# EAGLE design untitled (EAGLE 9.6.2)
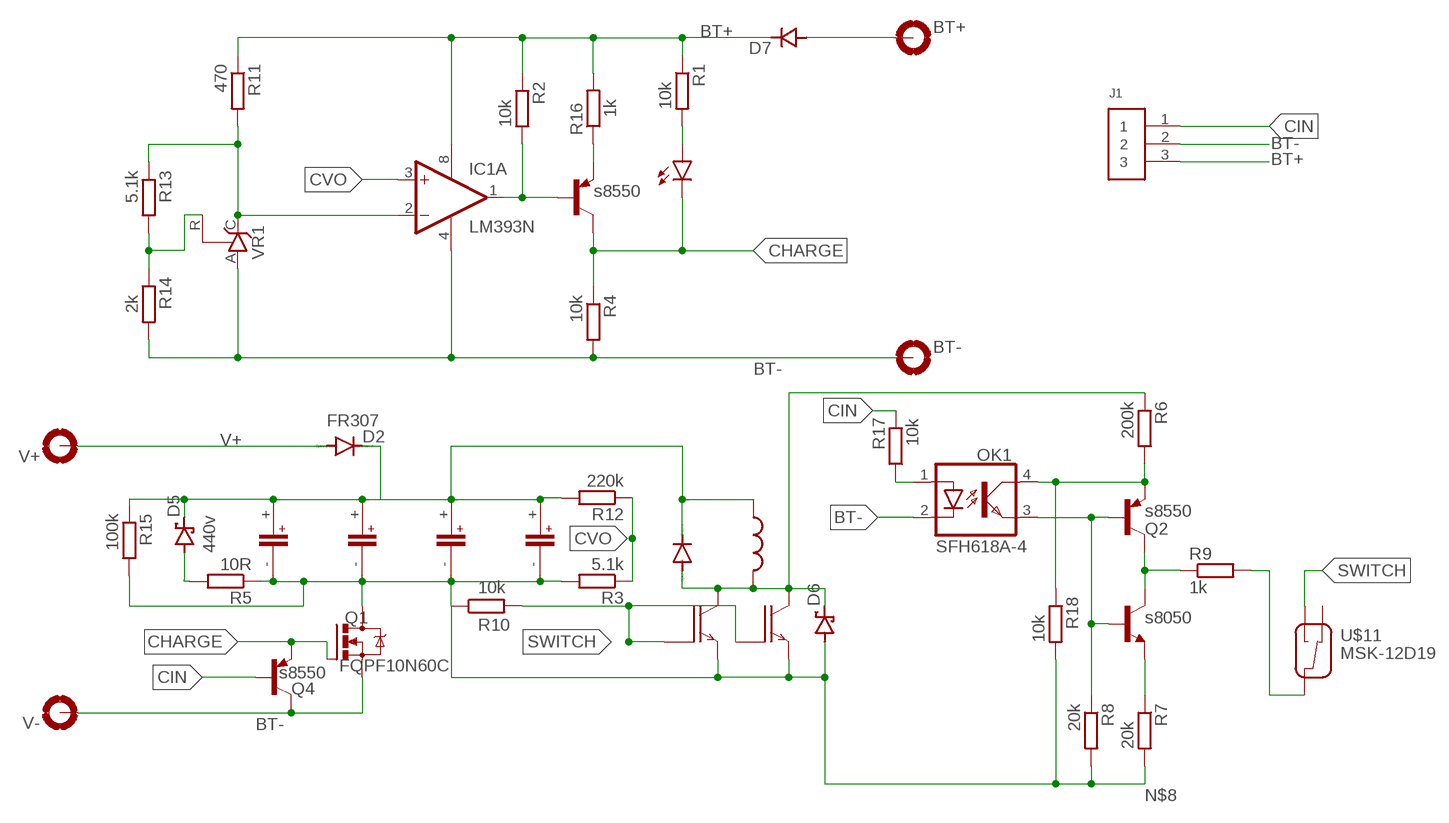
[diagram p0: schematic, sheet 1]

## Parts
BT+  MOUNT-PAD-ROUND3.0  [3,0-PAD]
BT-  MOUNT-PAD-ROUND3.0  [3,0-PAD]
D1  SB320  [DO201-15]
D2  FR307  1N5060GP  [DO15-12]
D5  440v  DS_E2L  [E2LINE]
D6  DS_E2L  [E2LINE]
D7  D_E2L  [E2LINE]
IC1  LM393N  [DIL08]
J1  61300311121  [61300311121]
LED1  TLLY4400  [LED3MM]
OK1  SFH618A-4  [DIP4]
Q1  FQPF10N60C  IRF740  [TO220BV]
Q2  s8550  2N3906  [TO92]
Q3  s8550  2N3906  [TO92]
Q4  s8550  2N3906  [TO92]
R1  10k  R-EU_0207/2V  [0207/2V]
R2  10k  R-EU_0207/2V  [0207/2V]
R3  5.1k  R-EU_0207/2V  [0207/2V]
R4  10k  R-EU_0207/2V  [0207/2V]
R5  10R  R-EU_0207/2V  [0207/2V]
R6  200k  R-EU_0207/2V  [0207/2V]
R7  20k  R-EU_0207/2V  [0207/2V]
R8  20k  R-EU_0207/2V  [0207/2V]
R9  1k  R-EU_0309/12  [0309/12]
R10  10k  R-EU_0207/2V  [0207/2V]
R11  470  R-EU_0207/2V  [0207/2V]
R12  220k  R-EU_0207/2V  [0207/2V]
R13  5.1k  R-EU_0207/2V  [0207/2V]
R14  2k  R-EU_0207/2V  [0207/2V]
R15  100k  R-EU_0207/2V  [0207/2V]
R16  1k  R-EU_0207/2V  [0207/2V]
R17  10k  R-EU_0207/2V  [0207/2V]
R18  10k  R-EU_0207/2V  [0207/2V]
T3  s8050  2N3704  [TO92]
U$1  RUBYCON_450V_270UF  [RUBYCON_22*40]
U$2  RUBYCON_450V_270UF  [RUBYCON_22*40]
U$3  RUBYCON_450V_270UF  [RUBYCON_22*40]
U$4  RUBYCON_450V_270UF  [RUBYCON_22*40]
U$6  COIL-301025  [30*10*25]
U$9  IGBT-N-TO247  [TO-247AD-V]
U$11  MSK-12D19  [12D19]
U$13  IGBT-N-TO247  [TO-247AD-V]
V+  MOUNT-PAD-ROUND3.0  [3,0-PAD]
V-  MOUNT-PAD-ROUND3.0  [3,0-PAD]
VR1  TL431CLP  [TO92-CLP]

## Nets
BT+: D7.1(C) IC1.8(P:V+) J1.3 R1.1 R2.1 R11.1 R16.2
BT-: BT-.B3,0(MOUNT) IC1.4(P:V-) J1.2 OK1.2(C) Q1.S Q4.1(C) R4.2 R14.2 V-.B3,0(MOUNT) VR1.A
CHARGE: LED1.K(C) Q1.G Q3.1(C) Q4.3(E) R4.1
CIN: J1.1 Q4.2(B) R17.2
CVO: IC1.3(A:+IN) R3.1 R12.1
N$1: IC1.1(A:OUT) Q3.2(B) R2.2
N$2: BT+.B3,0(MOUNT) D7.2(A)
N$3: D5.2(A) R5.2
N$4: D1.A D6.1(K) R6.1 U$6.P$2 U$9.C U$13.C
N$5: IC1.2(A:-IN) R11.2 R13.1 VR1.C
N$6: LED1.A R1.2
N$7: R13.2 R14.1 VR1.R
N$8: D6.2(A) Q1.D R3.2 R5.1 R7.2 R8.2 R10.1 R15.2 R18.2 U$1.- U$2.- U$3.- U$4.- U$9.E U$13.E
N$9: Q2.1(C) R9.1 T3.2(C)
N$10: Q3.3(E) R16.1
N$11: OK1.4(COL) Q2.3(E) R6.2 R18.1
N$12: OK1.1(A) R17.1
N$13: R7.1 T3.3(E)
N$14: OK1.3(EMIT) Q2.2(B) R8.1 T3.1(B)
N$15: R9.2 U$11.COM
SWITCH: R10.2 U$9.G U$11.NO U$13.G
UC: D1.C D2.C D5.1(K) R12.2 R15.1 U$1.+ U$2.+ U$3.+ U$4.+ U$6.P$1
V+: D2.A V+.B3,0(MOUNT)
Unconnected: IC1.5(B:+IN) IC1.6(B:-IN) IC1.7(B:OUT) U$11.NC

## Library data of the parts
BT+ BT- V+ V- = holes:MOUNT-PAD-ROUND: MOUNTING PAD, round
D1 = diode:SB320: DIODE barrier rectifier, 3 A (Fairchild)
D2 = diode:1N5060GP: DIODE controlled avalanche rectifier
D5 D6 = zetex:DS_E2L: SHOTTKY DIODE; OC_FARNELL: unknown; OC_NEWARK: unknown
D7 = zetex:D_E2L: DIODE; OC_FARNELL: unknown; OC_NEWARK: unknown
IC1 = linear:LM393: COMPARATOR
J1 = Headers:61300311121: CONN HEADER VERT 3POS 2.54MM Manufacturer's datasheet <https://katalog.we-online.de/em/datasheet/6130xx11121.pdf>; CREATED_BY: PCBLayout.com; DIGI_KEY_PART_NUMBER: 732-5316-ND; MANUFACTURER: Wurth Electronics Inc.; MPN: 61300311121
LED1 = led:TLLY4400: Low Current (2mA) LED 3 mm Tinted Diffused Package color YELLOW Source: Data sheet <http://www.farnell.com/datasheets/391098.pdf>; MF: VISHAY SEMICONDUCTOR; OC_FARNELL: 1612439
OK1 = optocoupler:SFH618?*: Optocoupler, Phototransistor Output, Low Input Current Source: Data sheet <http://www.vishay.com/docs/83673/sfh618.pdf>; MF: VISHAY/TELEFUNKEN; MPN: SFH618A-4; OC_FARNELL: 5805673; OC_NEWARK: 21H7746
Q1 = transistor-power:IRF740: N-CHANNEL MOS FET
Q2-Q4 = transistor-pnp:2N3906: PNP Transistor
R1-R18 = rcl:R-EU_: RESISTOR, European symbol; SPICEPREFIX: R
T3 = transistor:2N3704: NPN TRANSISTOR
U$1-U$4 = untitled:RUBYCON_450V_270UF
U$6 = untitled:COIL-30*10*25
U$9 U$13 = untitled:IGBT-N-TO247
U$11 = untitled:MSK-12D19
VR1 = v-reg:TL431CLP: VOLTAGE REGULATOR

## Board
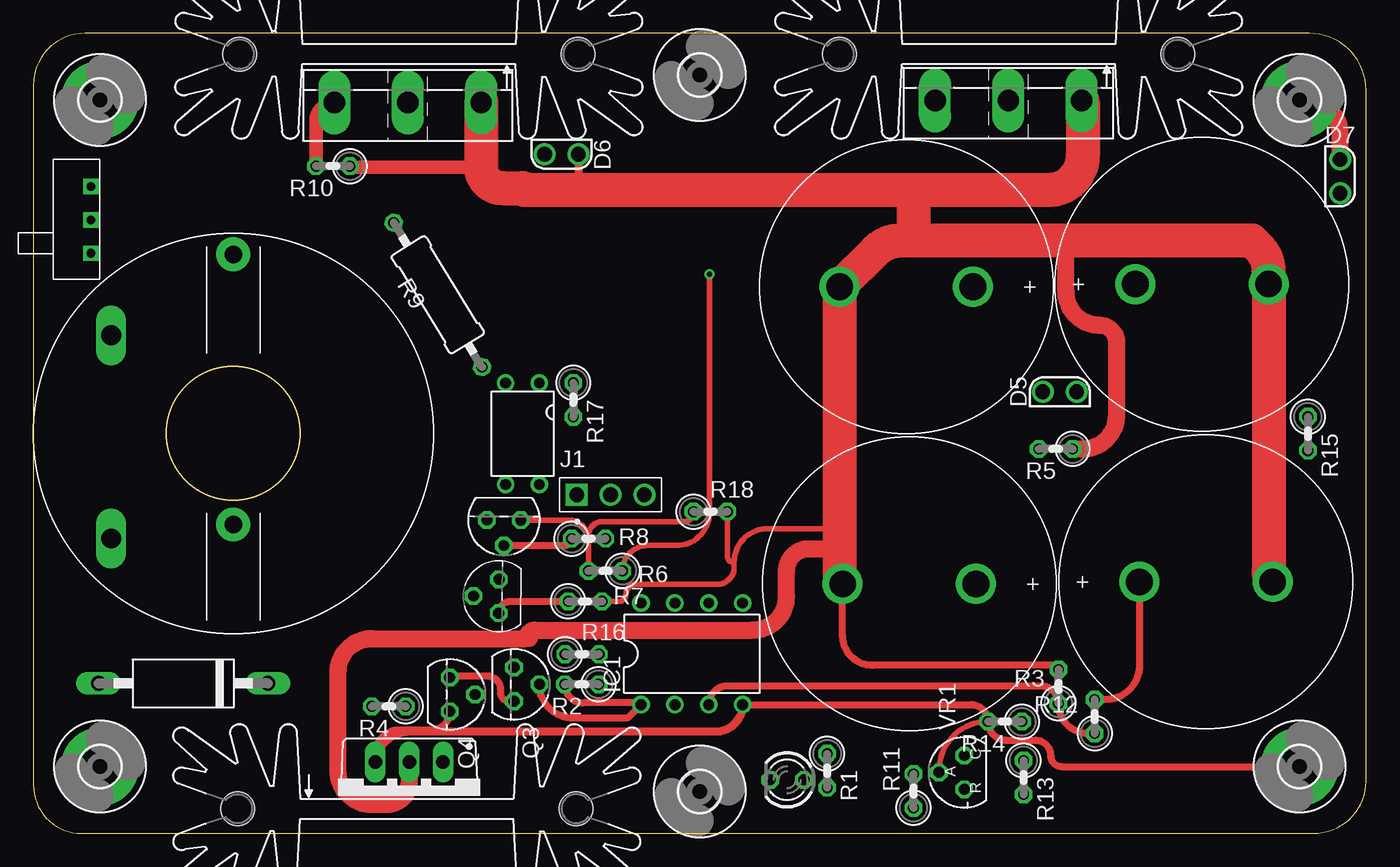
[diagram p1: board, top side]
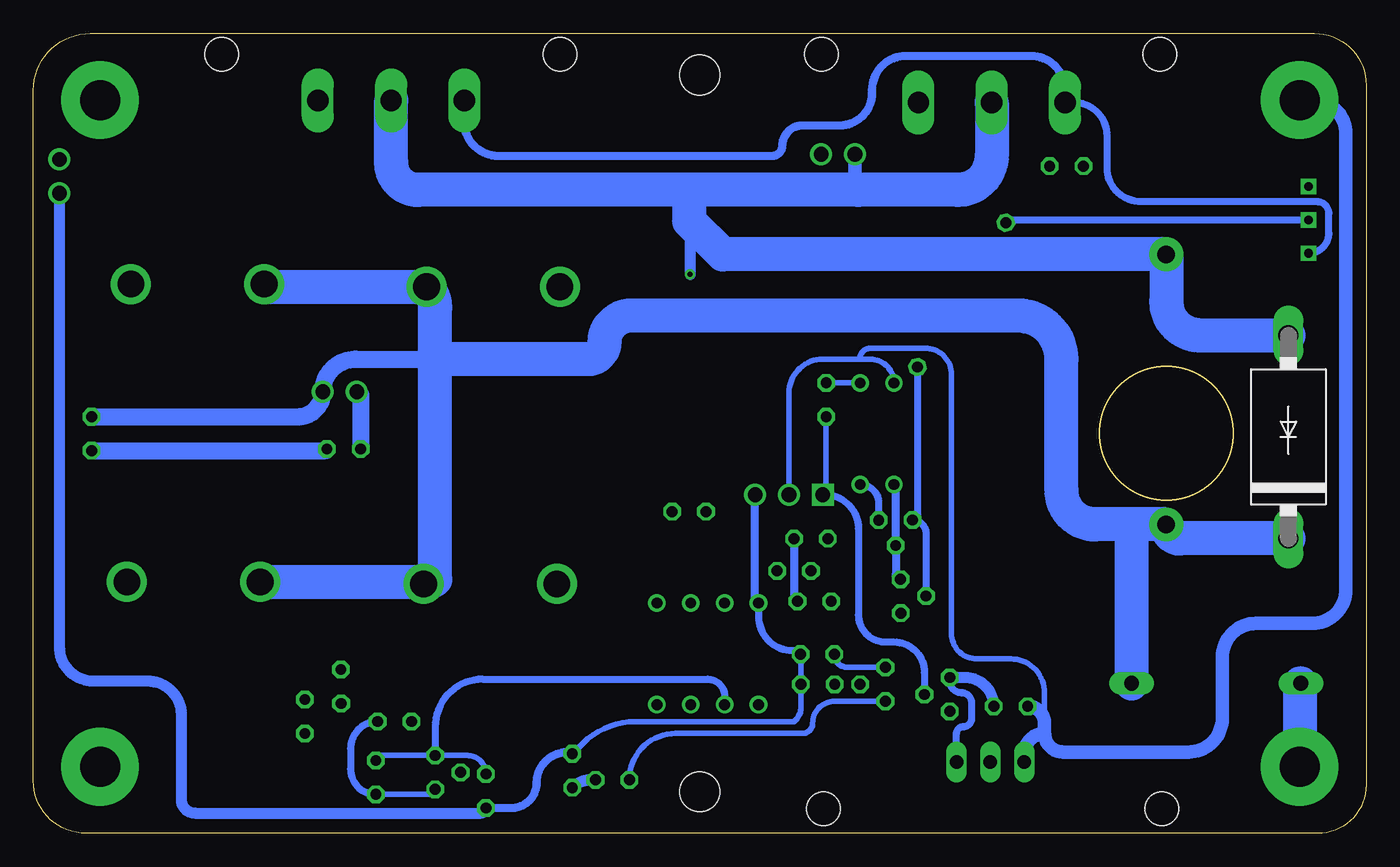
[diagram p2: board, bottom side, seen from below]

Size 100 x 60 mm. Coordinates in mm from the lower left corner, seen from the top.
Outline: 100,3.94 100,55.71 arc90 95.71,60 3.88,60 arc90 0,56.12 0,3.63 arc90 3.63,0 96.06,0 arc90 100,3.94
Copper layers (1*16): Top 0.035mm / dielectric 1.5mm / Bottom 0.035mm
Design rules "default": minimum track width 6mil, minimum drill 0.35mm, track to track 6mil, track to pad 6mil, pad to pad 6mil, via to via 6mil, smd to smd 6mil, copper to edge 40mil, drill to drill 6mil, minimum pad ring 10mil, minimum via ring 8mil, stop-mask expansion 4mil, vias tented up to drill 0mil, thermal gap 10mil

### Footprints (pad centres in the part's own frame; a part is rotated, then mirrored left to right if it is on the bottom)
3,0-PAD = drill 3 pad 5.842: B3,0 0,0
DO201-15 = drill 1.499 long: A 7.62,0; C -7.62,0
DO15-12 = drill 1.118 long: A 6.35,0; C -6.35,0
E2LINE = drill 1.1 pad 1.397: 1 0,-1.27; 2 0,1.27
DIL08 = drill 0.813 pad 1.27: 1 -3.81,-3.81; 2 -1.27,-3.81; 3 1.27,-3.81; 4 3.81,-3.81; 5 3.81,3.81; 6 1.27,3.81; 7 -1.27,3.81; 8 -3.81,3.81
61300311121 = drill 1.1 square: 1 -2.54,0 | drill 1.1: 2 0,0; 3 2.54,0
LED3MM = drill 0.813 octagon: A -1.27,0; K 1.27,0
DIP4 = drill 0.8: 1 -1.27,-3.81; 2 1.27,-3.81; 3 1.27,3.81; 4 -1.27,3.81
TO220BV = drill 1.016 long: D 0,-2.54; G -2.54,-2.54; S 2.54,-2.54
TO92 = drill 0.813 octagon: 1 1.27,0; 2 0,1.905; 3 -1.27,0
0207/2V = drill 0.813 octagon: 1 -1.27,0; 2 1.27,0
0309/12 = drill 0.813 octagon: 1 -6.35,0; 2 6.35,0
RUBYCON_22*40 = drill 2: + 5,0; - -5,0
SK104 = hole 2.54: -12.7,-0.762; 12.7,-0.762
30*10*25 = drill 1.3 pad 2.54: P$1 0,6.825; P$2 0,-13.429
3,0 = hole 3: 0,0
TO-247AD-V = drill 1.6 long: C 0,-2.54; E 5.5,-2.54; G -5.5,-2.54
12D19 = drill 0.65 square: COM 0.009,-1.024; NC 2.509,-1.024; NO -2.491,-1.024
TO92-CLP = drill 0.813 octagon: A 0,1.905; C 1.27,0; R -1.27,0

### Placement (x,y rotation side)
BT+  95,55 0 top
BT-  95,5 0 top
D1  5.83,29.73 90 bottom
D2  11.25,11.25 180 top
D5  77.01,33.12 90 top
D6  39.62,50.93 270 top
D7  98.04,49.28 0 top
IC1  49.4,13.46 0 top
J1  43.31,25.4 0 top
LED1  56.55,4.01 180 top
OK1  36.7,29.97 180 top
Q1  28.2,2.81 180 top
Q2  35.31,23.5 179.7 top
Q3  36.07,11.18 270 top
Q4  31.24,10.41 270 top
R1  59.56,4.7 270 top
R2  41.15,11.18 180 top
R3  76.92,11.01 89.6 top
R4  26.67,9.53 180 top
R5  76.71,28.83 180 top
R6  42.93,19.68 180 top
R7  41.4,17.4 0 top
R8  41.66,22.1 0 top
R9  30.35,40.39 121.5 top
R10  22.48,50.04 180 top
R11  66.04,3.17 90 top
R12  79.63,8.76 90 top
R13  74.3,4.19 270 top
R14  72.9,8.38 180 top
R15  95.63,29.97 270 top
R16  41.17,13.43 0 top
R17  40.51,32.51 270 top
R18  50.8,24.13 0 top
T3  34.92,17.78 89.5 top
U$1  87.68,41.19 180 top
U$2  87.98,18.86 180 top
U$3  65.5,40.99 0 top
U$4  65.72,18.7 0 top
U$5  [SK104]  28.18,57.68 180 top
U$6  COIL-3010*25  [30*10*25]  15,29.99 180 top
U$7  [3,0]  50,56.88 0 top
U$8  [3,0]  50,3.12 0 top
U$9  28.1,57.34 0 top
U$10  [SK104]  28.02,2.61 0 top
U$11  3.3,45.99 90 top
U$13  73.16,57.51 0 top
U$14  [SK104]  73.18,57.68 180 top
V+  5,5 0 top
V-  5,55 0 top
VR1  69.85,4.57 90 top

### Tracks (layer width: path | path; a pad name or v marks a point on that pad's centre or on a via)
BT+
  Bottom 0.406: R1.1 59.43,6.09 58.77,6.75 arc45 54.83,8.38 42.93,8.38 42.8,8.51 arc-45 42.42,9.43 R2.1 42.42,13.41 | 42.42,13.41 42.42,13.72 | 42.42,13.41 arc-90 R16.2 arc-90 42.57,13.56
  Bottom 0.508: IC1.8 45.59,16.26 arc-90 43.05,13.72 42.42,13.72
  Bottom 0.61: R11.1 64.14,1.91 arc-90 62.23,3.81 arc90 59.95,6.09 59.43,6.09 | IC1.8 arc-90 45.85,17.53 J1.3
  Bottom 0.813: D7.1 98.04,13.97 arc-90 95.5,11.43 91.44,11.43 arc90 88.9,8.89 88.9,2.54 arc-90 87.88,1.52 66.42,1.52 arc-90 R11.1
BT-
  Top 0.406: VR1.A 67.94,4.7 arc-90 R14.2
  Top 0.508: IC1.4 70.36,9.65 arc-90 R14.2 arc90 73.03,6.99 75.18,6.99 arc-90 76.33,5.84 arc90 77.17,5 BT-.B3,0 | Q4.1 arc-90 29.84,7.75 27.43,7.75 arc90 25.66,5.97 25.66,5.08
  Top 0.61: IC1.4 arc-90 51.18,7.62 28.2,7.62 arc90 25.66,5.08 Q1.S 25.66,5.46
  Bottom 0.406: OK1.2 arc-90 37.21,35.56 38,35.56 | J1.2 43.31,33.02 arc90 40.77,35.56 38,35.56 | 38,35.56 arc90 37.17,36.39 33.09,36.39 arc90 31.11,34.42 31.11,14.99 arc-90 29.21,13.08 26.67,13.08 arc90 24.13,10.54 24.13,7.49
  Bottom 1.016: V-.B3,0 4.06,55 arc90 1.52,52.46 1.52,18.29 arc90 4.06,15.75 8.26,15.75 arc-90 10.79,13.21 10.79,8.64 arc90 13.34,6.1 22.73,6.1 arc90 24.13,7.49 | 24.13,7.49 24.13,8.26 arc-90 R4.2 | 24.13,7.49 arc-90 25.66,5.96 Q1.S
CHARGE
  Top 0.508: Q4.3 arc-90 31.37,11.81 34.04,11.81 arc-90 35.05,10.79 35.05,10.54 arc90 35.69,9.91 Q3.1
  Bottom 0.406: Q3.1 39.88,9.91 arc-90 41.53,8.26 arc90 42.29,7.49 51.82,7.49 arc-90 55.28,4.03 LED1.K
  Bottom 0.508: R4.1 28.2,9.53 | Q4.3 31.24,11.43 arc-90 30.35,10.54 arc90 29.59,9.78 29.59,8.64 arc90 30.23,8 arc-90 30.74,7.49 Q1.G
  Bottom 0.813: R4.1 arc-90 30.1,11.68 Q4.3
CIN
  Bottom 0.406: R17.2 40.51,25.65 arc90 J1.1
  Bottom 0.508: 40.64,25.4 arc90 38.1,22.86 38.1,16.38 arc-90 36.07,14.35 35.43,14.35 arc90 33.15,12.06 Q4.2
  Bottom 0.61: J1.1 40.64,25.4
CVO
  Top 0.508: R12.1 79.16,7.49 arc-90 R3.1 arc90 75.6,11.05 52.07,11.05 arc90 IC1.3
N$1
  Top 0.508: Q3.2 arc90 40.51,8.64 44.58,8.64 IC1.1 45.47,9.78 41.27,9.78 arc-90 R2.2
N$2
  Top 1.27: D7.2 98.04,52.46 arc90 95.5,55 BT+.B3,0 arc90 95.25,55.25 95.25,55.88
N$3
  Bottom 1.27: D5.2 arc90 75.44,32.82 R5.2
N$4  (via drill 0.35)
  Top 0.406: v50.73,41.93 50.73,24.06 arc-90 48.26,21.59 46.1,21.59 arc90 R6.1
  Bottom 0.813: 50.73,45.89 v50.73,41.93
  Bottom 1.016: D6.1 38.35,48.51 arc-90 38.1,48.26
  Bottom 2.54: U$9.C 28.1,50.8 arc90 30.64,48.26 38.1,48.26 50.8,48.26 | 50.8,48.26 71.12,48.26 arc90 73.16,50.3 U$13.C | D1.A 12.46,37.35 arc90 15,39.89 U$6.P$2 48.26,43.42 50.73,45.89 arc90 50.8,45.96 50.8,48.26
N$5
  Bottom 0.406: R11.2 arc-90 67.44,5.84 VR1.C 73.91,5.84 R13.1
  Bottom 0.508: VR1.C 69.85,8 arc90 66.29,11.56 49.4,11.56 arc90 48.13,10.29 IC1.2
N$6
  Bottom 0.813: LED1.A 58.15,4.01 arc-45 R1.2
N$7
  Bottom 0.406: VR1.R 70.23,2.92 R13.2
  Bottom 0.508: R14.1 arc-90 76.2,6.35 76.2,4.83 arc-90 R13.2
N$8
  Top 0.406: 60.5,22.86 55.12,22.86 arc90 52.58,20.32 | 52.58,20.32 52.58,19.94 arc-90 51.31,18.67 45.21,18.67 arc90 44.45,17.91 arc-90 43.94,17.4 R7.2 | R18.2 52.07,20.83 arc90 52.58,20.32
  Top 0.508: R3.2 76.61,12.6 62.94,12.6 arc-90 60.72,14.82 U$4.-
  Top 0.61: D6.2 40.89,48.51 arc-90 40.64,48.26
  Top 1.016: 40.89,48.51 arc-90 40.64,48.26 | R10.1 arc90 23.82,49.97 33.6,49.97
  Top 1.27: R5.1 78.74,28.83 arc90 81.28,31.37 81.28,36.83 arc90 80.01,38.1 arc-90 77.47,40.64 77.47,44.45 | U$13.E arc90 78.74,54.89 | Q1.D 28.2,3.81 arc-90 26.54,2.16 25.4,2.16 arc-90 22.86,4.7 22.86,12.06 arc-90 25.4,14.61 37,14.61 | 37.21,14.61 37,14.61 | 60.5,21.34 58.17,21.34 arc90 56.52,19.68 56.52,17.78 arc-90 53.98,15.24 37.63,15.24 arc90 37,14.61
  Top 2.54: 66.04,48.26 40.64,48.26 36.83,48.26 arc90 36.7,48.39 35.18,48.39 arc-90 33.6,49.97 U$9.E | 66.04,48.26 76.2,48.26 arc90 78.74,50.8 78.74,54.89 | U$2.- arc-45 92.68,19.6 U$1.- 92.68,42.16 arc45 91.94,43.95 91.44,44.45 77.47,44.45 66.04,44.45 | U$4.- arc-45 60.5,19.24 60.5,21.34 60.5,22.86 U$3.- 63.22,43.71 arc-45 65.01,44.45 66.04,44.45 | 66.04,48.26 66.04,44.45
  Bottom 0.61: R8.2 42.93,17.65 arc-90 R7.2
  Bottom 1.27: R15.2 78.11,28.7 arc-90 R5.1
N$9
  Bottom 0.508: R9.1 33.67,23.87 arc90 Q2.1 arc90 33.02,22.49 T3.2
N$10
  Bottom 0.406: Q3.3 38.91,12.45 arc90 R16.1
N$11
  Top 0.406: R18.1 arc-90 48.77,23.37 42.67,23.37 arc90 41.66,22.35 41.66,22 | 41.66,22 R6.2 | Q2.3 40.17,23.49 arc-90 41.66,22
  Bottom 0.508: OK1.4 arc90 36.58,24.77 Q2.3
N$12
  Bottom 0.406: R17.1 OK1.1
N$13
  Top 0.508: T3.3 arc-90 35.8,17.4 R7.1
N$14
  Top 0.508: Q2.2 39.88,21.59 arc90 R8.1
  Bottom 0.61: OK1.3 35.31,26.04 Q2.2 arc-90 Q2.2 35.3,19.41 arc-90 T3.1
N$15
  Bottom 0.508: R9.2 26.83,46 U$11.COM
SWITCH
  Top 1.016: R10.2 21.21,53.41 arc-90 U$9.G
  Bottom 0.508: U$11.NO arc-90 2.79,45.03 2.79,46.48 arc-90 3.68,47.37 16.89,47.37 arc90 19.43,49.91 19.43,52.32 arc-90 21.91,54.8 U$9.G
  Bottom 0.61: U$9.G 22.6,55.75 arc-90 25.14,58.29 34.54,58.29 arc-90 37.08,55.75 37.08,55.5 arc90 39.5,53.09 42.29,53.09 arc-90 43.81,51.56 arc90 44.58,50.8 65.11,50.8 arc90 67.66,53.34 U$13.G
UC
  Top 0.508: U$2.+ 82.98,12.57 arc-90 80.44,10.03 R12.2
  Bottom 1.27: 69.85,35.56 75.83,35.56 arc-90 D5.1 arc90 80.15,31.24 R15.1
  Bottom 2.54: D1.C 13.95,22.11 arc90 U$6.P$1 17.78,23.17 | U$1.+ arc-45 82.2,40.99 U$3.+ arc45 69.85,39.42 69.85,35.56 | U$2.+ 70.3,18.86 | 70.3,18.86 arc-45 69.85,19.05 69.85,35.56 | 17.78,23.17 20.32,23.17 arc90 22.86,25.71 22.86,35.56 arc-90 26.14,38.84 55.15,38.84 arc-90 57.15,36.83 arc90 58.42,35.56 69.85,35.56 | D2.C 17.6,22.99 arc-90 17.78,23.17 | U$4.+ 70.46,18.7 arc-90 70.3,18.86
V+
  Bottom 2.54: D2.A arc-90 5,11.15 V+.B3,0